# Altium schematic sheet MotherBoard.SchDoc
size A4
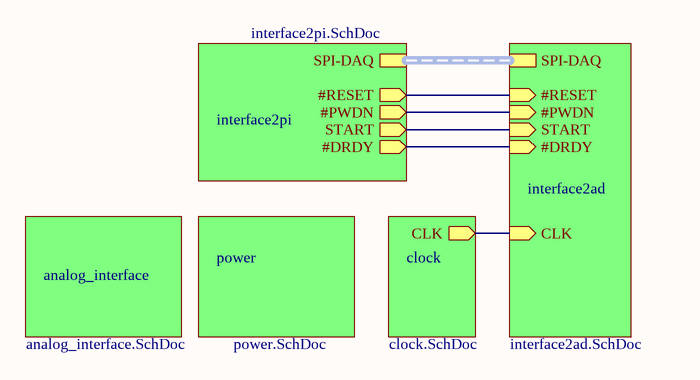
[diagram p0: MotherBoard.SchDoc]

## Sub-sheets
analog_interface = analog_interface.SchDoc: no entries
clock = clock.SchDoc: CLK (out)
interface2ad = interface2ad.SchDoc: SPI-DAQ (harness SPI-DAQ), #RESET (in), #PWDN (in), START (in), #DRDY (in), CLK (in)
interface2pi = interface2pi.SchDoc: SPI-DAQ (harness SPI-DAQ), #RESET (out), #PWDN (out), START (out), #DRDY (out)
power = power.SchDoc: no entries

## Nets
(unnamed): sheet clock/CLK, sheet interface2ad/CLK
(unnamed): sheet interface2pi/#RESET, sheet interface2ad/#RESET
(unnamed): sheet interface2pi/#PWDN, sheet interface2ad/#PWDN
(unnamed): sheet interface2pi/START, sheet interface2ad/START
(unnamed): sheet interface2pi/#DRDY, sheet interface2ad/#DRDY

## Buses and harness runs
harness sheet interface2ad/SPI-DAQ = sheet interface2pi/SPI-DAQ